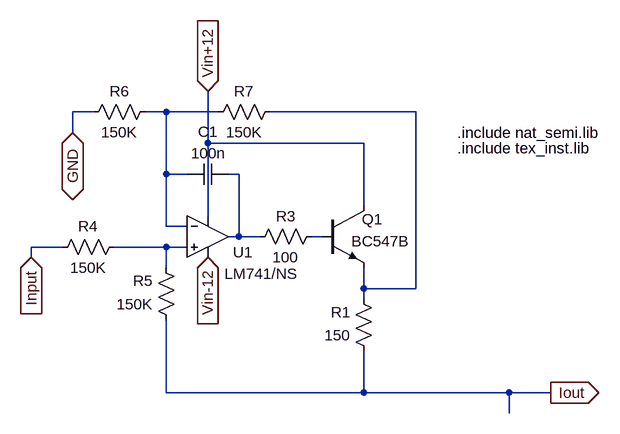
[diagram p0: schematic Component_2.asc]
Component_2.asc, the LTspice schematic file:
Version 4
SHEET 1 936 680
WIRE -272 -48 -304 -48
WIRE -160 -48 -192 -48
WIRE -80 -48 -160 -48
WIRE 224 -48 0 -48
WIRE -304 -16 -304 -48
WIRE -96 0 -96 -80
WIRE 144 0 -96 0
WIRE -160 48 -160 -48
WIRE -128 48 -160 48
WIRE -48 48 -64 48
WIRE 144 96 144 0
WIRE -96 112 -96 0
WIRE -160 128 -160 48
WIRE -128 128 -160 128
WIRE -48 144 -48 48
WIRE -48 144 -64 144
WIRE -16 144 -48 144
WIRE 80 144 64 144
WIRE -320 160 -368 160
WIRE -160 160 -240 160
WIRE -128 160 -160 160
WIRE -368 176 -368 160
WIRE -160 192 -160 160
WIRE 144 224 144 192
WIRE 224 224 224 -48
WIRE 224 224 144 224
WIRE 144 240 144 224
WIRE -160 384 -160 272
WIRE 144 384 144 320
WIRE 144 384 -160 384
WIRE 368 384 144 384
WIRE 432 384 368 384
WIRE 368 416 368 384
FLAG 432 384 Iout
IOPIN 432 384 Out
FLAG -96 -80 Vin+12
IOPIN -96 -80 In
FLAG -96 176 Vin-12
IOPIN -96 176 In
FLAG -368 176 Input
IOPIN -368 176 In
FLAG -304 -16 GND
IOPIN -304 -16 BiDir
SYMBOL OpAmps\\opamp2 -96 80 R0
WINDOW 0 39 88 Left 2
WINDOW 3 26 121 Left 2
SYMATTR InstName U1
SYMATTR Value LM741/NS
SYMBOL npn 80 96 R0
WINDOW 0 61 21 Left 2
WINDOW 3 45 55 Left 2
SYMATTR InstName Q1
SYMATTR Value BC547B
SYMBOL res 160 336 R180
WINDOW 0 36 76 Left 2
WINDOW 3 36 40 Left 2
SYMATTR InstName R1
SYMATTR Value 150
SYMBOL res 80 128 R90
WINDOW 0 0 56 VBottom 2
WINDOW 3 32 56 VTop 2
SYMATTR InstName R3
SYMATTR Value 100
SYMBOL res -224 144 R90
WINDOW 0 0 56 VBottom 2
WINDOW 3 32 56 VTop 2
SYMATTR InstName R4
SYMATTR Value 150K
SYMBOL res -144 288 R180
WINDOW 0 36 76 Left 2
WINDOW 3 36 40 Left 2
SYMATTR InstName R5
SYMATTR Value 150K
SYMBOL cap -64 32 R90
WINDOW 0 -34 32 VBottom 2
WINDOW 3 -32 31 VTop 2
SYMATTR InstName C1
SYMATTR Value 100n
SYMBOL res -176 -64 R90
WINDOW 0 0 56 VBottom 2
WINDOW 3 32 56 VTop 2
SYMATTR InstName R6
SYMATTR Value 150K
SYMBOL res 16 -64 R90
WINDOW 0 0 56 VBottom 2
WINDOW 3 32 56 VTop 2
SYMATTR InstName R7
SYMATTR Value 150K
TEXT 288 -16 Left 2 !.include nat_semi.lib
TEXT 288 8 Left 2 !.include tex_inst.lib

The netlist it stands for:
* Component_2.asc
XU1 N005 N001 Vin+12 Vin-12 N003 LM741/NS  ; pins In+ In- V+ V- OUT
Q1 Vin+12 N004 N002 0 BC547B
R1 Iout N002 150
R3 N004 N003 100
R4 N005 Input 150K
R5 Iout N005 150K
C1 N003 N001 100n
R6 N001 GND 150K
R7 N002 N001 150K
.model NPN NPN
.model PNP PNP
.lib standard.bjt
.include nat_semi.lib
.include tex_inst.lib
.backanno
.end